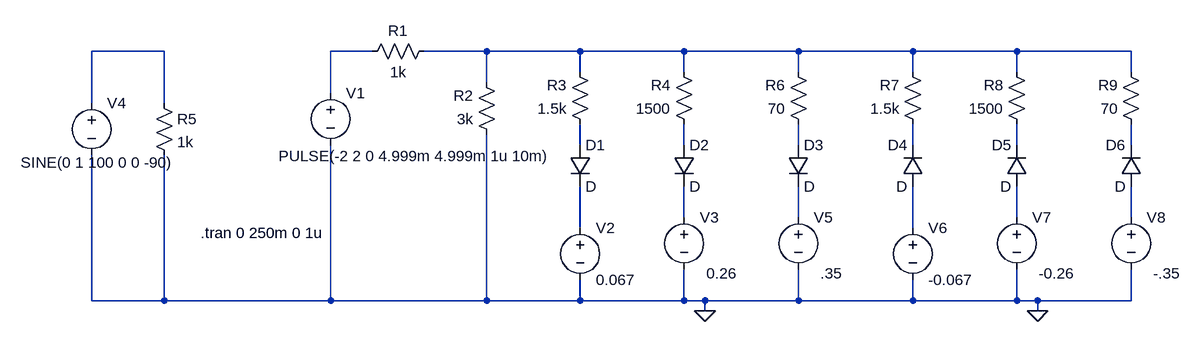
[diagram p0: schematic shaping.asc]
shaping.asc, the LTspice schematic file:
Version 4
SHEET 1 1348 680
WIRE -224 80 -336 80
WIRE 96 80 32 80
WIRE 272 80 176 80
WIRE 416 80 272 80
WIRE 576 80 416 80
WIRE 752 80 576 80
WIRE 928 80 752 80
WIRE 1088 80 928 80
WIRE 1264 80 1088 80
WIRE 416 112 416 80
WIRE 576 112 576 80
WIRE 752 112 752 80
WIRE 928 112 928 80
WIRE 1088 112 1088 80
WIRE 1264 112 1264 80
WIRE 272 128 272 80
WIRE 32 144 32 80
WIRE -336 160 -336 80
WIRE -224 160 -224 80
WIRE 416 224 416 192
WIRE 576 224 576 192
WIRE 752 224 752 192
WIRE 928 224 928 192
WIRE 1088 224 1088 192
WIRE 1264 224 1264 192
WIRE 576 336 576 288
WIRE 752 336 752 288
WIRE 1088 336 1088 288
WIRE 1264 336 1264 288
WIRE 416 352 416 288
WIRE 928 352 928 288
WIRE -336 464 -336 240
WIRE -224 464 -224 240
WIRE -224 464 -336 464
WIRE 32 464 32 224
WIRE 32 464 -224 464
WIRE 272 464 272 208
WIRE 272 464 32 464
WIRE 416 464 416 432
WIRE 416 464 272 464
WIRE 576 464 576 416
WIRE 576 464 416 464
WIRE 608 464 576 464
WIRE 752 464 752 416
WIRE 752 464 608 464
WIRE 928 464 928 432
WIRE 928 464 752 464
WIRE 1088 464 1088 416
WIRE 1088 464 928 464
WIRE 1120 464 1088 464
WIRE 1264 464 1264 416
WIRE 1264 464 1120 464
WIRE 608 480 608 464
WIRE 1120 480 1120 464
FLAG 608 480 0
FLAG 1120 480 0
SYMBOL voltage 32 128 R0
WINDOW 3 -80 113 Left 2
WINDOW 123 0 0 Left 0
WINDOW 39 0 0 Left 0
SYMATTR InstName V1
SYMATTR Value PULSE(-2 2 0 4.999m 4.999m 1u 10m)
SYMBOL res 192 64 R90
WINDOW 0 0 56 VBottom 2
WINDOW 3 32 56 VTop 2
SYMATTR InstName R1
SYMATTR Value 1k
SYMBOL res 288 224 R180
WINDOW 0 36 76 Left 2
WINDOW 3 36 40 Left 2
SYMATTR InstName R2
SYMATTR Value 3k
SYMBOL res 432 208 R180
WINDOW 0 36 76 Left 2
WINDOW 3 36 40 Left 2
SYMATTR InstName R3
SYMATTR Value 1.5k
SYMBOL res 592 208 R180
WINDOW 0 36 76 Left 2
WINDOW 3 36 40 Left 2
SYMATTR InstName R4
SYMATTR Value 1500
SYMBOL diode 400 224 R0
SYMATTR InstName D1
SYMBOL diode 560 224 R0
SYMATTR InstName D2
SYMBOL voltage 416 336 R0
WINDOW 123 0 0 Left 0
WINDOW 39 0 0 Left 0
SYMATTR InstName V2
SYMATTR Value 0.067
SYMBOL voltage 576 320 R0
WINDOW 3 34 102 Left 2
WINDOW 123 0 0 Left 0
WINDOW 39 0 0 Left 0
SYMATTR InstName V3
SYMATTR Value 0.26
SYMBOL voltage -336 144 R0
WINDOW 3 -109 107 Left 2
WINDOW 123 0 0 Left 0
WINDOW 39 0 0 Left 0
SYMATTR InstName V4
SYMATTR Value SINE(0 1 100 0 0 -90)
SYMBOL res -240 144 R0
SYMATTR InstName R5
SYMATTR Value 1k
SYMBOL res 768 208 R180
WINDOW 0 36 76 Left 2
WINDOW 3 36 40 Left 2
SYMATTR InstName R6
SYMATTR Value 70
SYMBOL diode 736 224 R0
SYMATTR InstName D3
SYMBOL voltage 752 320 R0
WINDOW 3 34 102 Left 2
WINDOW 123 0 0 Left 0
WINDOW 39 0 0 Left 0
SYMATTR InstName V5
SYMATTR Value .35
SYMBOL res 944 208 R180
WINDOW 0 36 76 Left 2
WINDOW 3 36 40 Left 2
SYMATTR InstName R7
SYMATTR Value 1.5k
SYMBOL res 1104 208 R180
WINDOW 0 36 76 Left 2
WINDOW 3 36 40 Left 2
SYMATTR InstName R8
SYMATTR Value 1500
SYMBOL diode 944 288 R180
WINDOW 0 24 64 Left 2
WINDOW 3 24 0 Left 2
SYMATTR InstName D4
SYMBOL diode 1104 288 R180
WINDOW 0 24 64 Left 2
WINDOW 3 24 0 Left 2
SYMATTR InstName D5
SYMBOL voltage 928 336 R0
WINDOW 123 0 0 Left 0
WINDOW 39 0 0 Left 0
SYMATTR InstName V6
SYMATTR Value -0.067
SYMBOL voltage 1088 320 R0
WINDOW 3 34 102 Left 2
WINDOW 123 0 0 Left 0
WINDOW 39 0 0 Left 0
SYMATTR InstName V7
SYMATTR Value -0.26
SYMBOL res 1280 208 R180
WINDOW 0 36 76 Left 2
WINDOW 3 36 40 Left 2
SYMATTR InstName R9
SYMATTR Value 70
SYMBOL diode 1280 288 R180
WINDOW 0 24 64 Left 2
WINDOW 3 24 0 Left 2
SYMATTR InstName D6
SYMBOL voltage 1264 320 R0
WINDOW 3 34 102 Left 2
WINDOW 123 0 0 Left 0
WINDOW 39 0 0 Left 0
SYMATTR InstName V8
SYMATTR Value -.35
TEXT -168 360 Left 2 !.tran 0 250m 0 1u

The netlist it stands for:
* shaping.asc
V1 N002 0 PULSE(-2 2 0 4.999m 4.999m 1u 10m)
R1 N003 N002 1k
R2 0 N003 3k
R3 N004 N003 1.5k
R4 N005 N003 1500
D1 N004 N014 D
D2 N005 N010 D
V2 N014 0 0.067
V3 N010 0 0.26
V4 N001 0 SINE(0 1 100 0 0 -90)
R5 N001 0 1k
R6 N006 N003 70
D3 N006 N011 D
V5 N011 0 .35
R7 N007 N003 1.5k
R8 N008 N003 1500
D4 N015 N007 D
D5 N012 N008 D
V6 N015 0 -0.067
V7 N012 0 -0.26
R9 N009 N003 70
D6 N013 N009 D
V8 N013 0 -.35
.model D D
.lib standard.dio
.tran 0 250m 0 1u
.backanno
.end